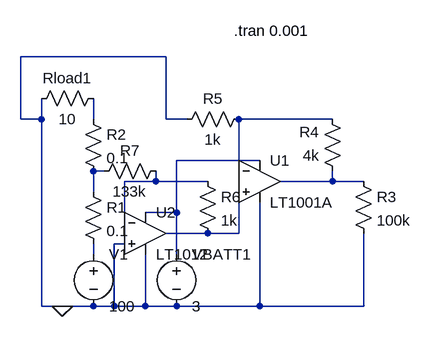
[diagram p0: schematic Scopometer.asc]
Scopometer.asc, the LTspice schematic file:
Version 4
SHEET 1 880 680
WIRE 352 112 128 112
WIRE 128 208 128 112
WIRE 160 208 160 176
WIRE 160 208 128 208
WIRE 240 208 240 176
WIRE 352 208 352 112
WIRE 384 208 352 208
WIRE 608 208 464 208
WIRE 496 272 368 272
WIRE 256 288 240 288
WIRE 464 288 464 208
WIRE 336 304 336 288
WIRE 336 304 288 304
WIRE 416 304 336 304
WIRE 608 304 608 288
WIRE 608 304 528 304
WIRE 656 304 608 304
WIRE 240 320 240 288
WIRE 368 352 368 272
WIRE 368 352 320 352
WIRE 288 368 288 304
WIRE 416 384 352 384
WIRE 464 384 464 320
WIRE 464 384 416 384
WIRE 288 400 272 400
WIRE 240 416 240 400
WIRE 368 416 368 352
WIRE 160 496 160 208
WIRE 192 496 160 496
WIRE 240 496 192 496
WIRE 272 496 272 400
WIRE 272 496 240 496
WIRE 320 496 320 416
WIRE 320 496 272 496
WIRE 368 496 320 496
WIRE 496 496 496 336
WIRE 496 496 368 496
WIRE 656 496 656 384
WIRE 656 496 496 496
FLAG 192 496 0
SYMBOL voltage 240 400 R0
SYMATTR InstName V1
SYMATTR Value 100
SYMBOL res 256 160 R90
WINDOW 0 0 56 VBottom 2
WINDOW 3 32 56 VTop 2
SYMATTR InstName Rload1
SYMATTR Value 10
SYMBOL res 224 304 R0
SYMATTR InstName R1
SYMATTR Value 0.1
SYMBOL res 224 192 R0
SYMATTR InstName R2
SYMATTR Value 0.1
SYMBOL Opamps/LT1001A 496 240 R0
SYMATTR InstName U1
SYMBOL voltage 368 400 R0
SYMATTR InstName VBATT1
SYMATTR Value 3
SYMBOL res 640 288 R0
SYMATTR InstName R3
SYMATTR Value 100k
SYMBOL res 624 304 R180
WINDOW 0 36 76 Left 2
WINDOW 3 36 40 Left 2
SYMATTR InstName R4
SYMATTR Value 4k
SYMBOL res 368 224 R270
WINDOW 0 32 56 VTop 2
WINDOW 3 0 56 VBottom 2
SYMATTR InstName R5
SYMATTR Value 1k
SYMBOL Opamps/LT1012 320 320 R0
SYMATTR InstName U2
SYMBOL res 400 288 R0
SYMATTR InstName R6
SYMATTR Value 1k
SYMBOL res 352 272 R90
WINDOW 0 0 56 VBottom 2
WINDOW 3 32 56 VTop 2
SYMATTR InstName R7
SYMATTR Value 133k
TEXT 456 72 Left 2 !.tran 0.001

The netlist it stands for:
* Scopometer.asc
V1 N008 0 100
Rload1 N001 0 10
R1 N004 N008 0.1
R2 N001 N004 0.1
XU1 N007 N002 N003 0 N006 LT1001  ; LT1001A, pins In+ In- V+ V- OUT
VBATT1 N003 0 3
R3 N006 0 100k
R4 N006 N002 4k
R5 0 N002 1k
XU2 0 N005 N003 0 N007 LT1012  ; pins In+ In- V+ V- OUT
R6 N005 N007 1k
R7 N005 N004 133k
.tran 0.001
.lib LTC.lib
.backanno
.end